# EAGLE schematic communication_module_20190522_with_TTGO-LoRa32 (EAGLE 9.4.0)
AUTHOR: iPAS
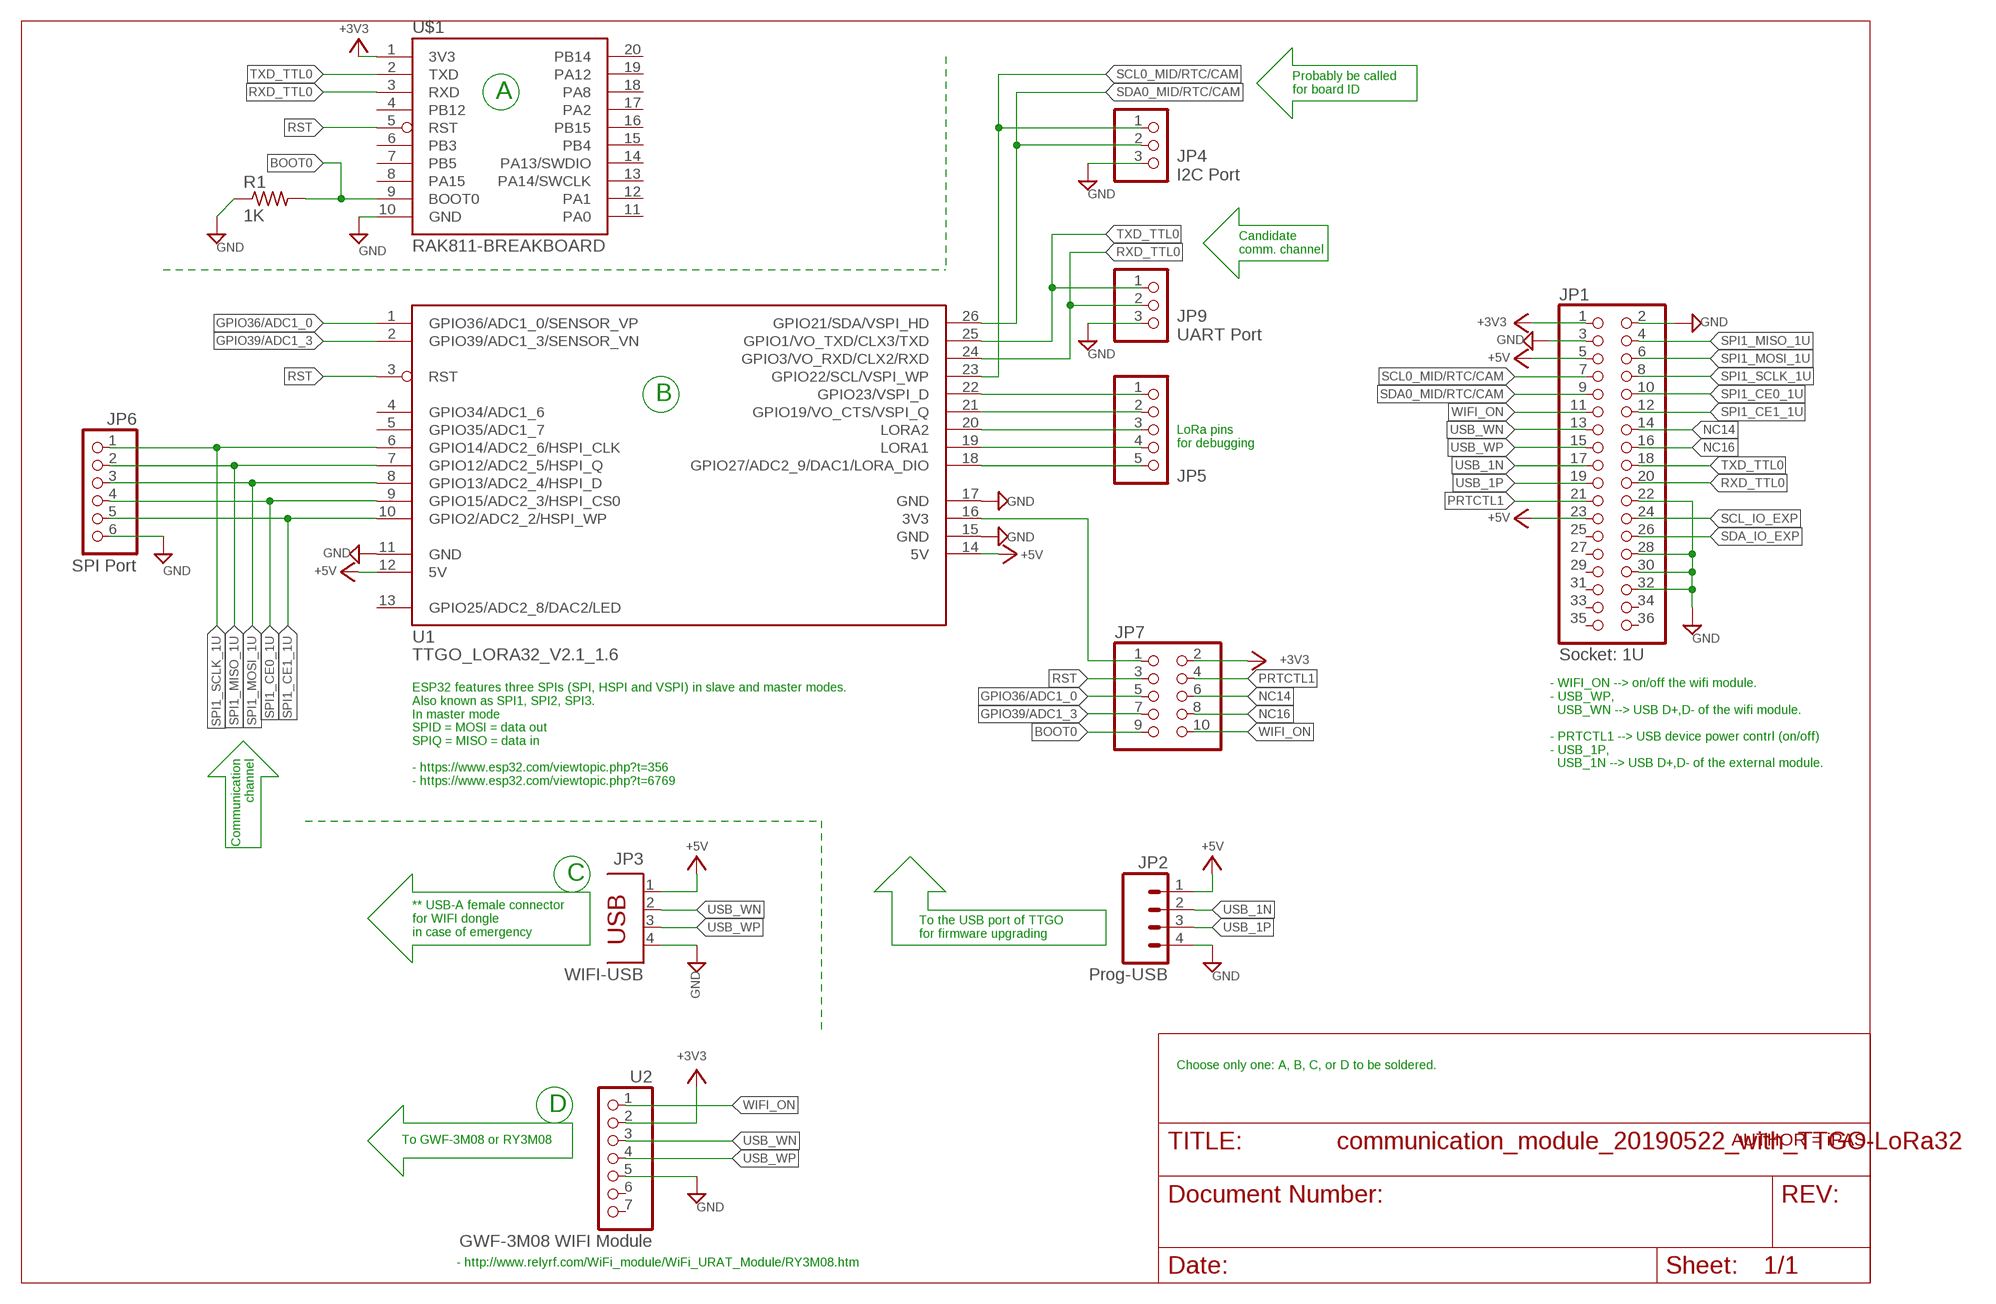
[diagram p0: schematic, sheet 1]
FRAME1 (DINA4_L): AUTHOR: iPAS

## Parts
JP1  Socket: 1U  PINHD-2X18  [2X18]
JP2  Prog-USB  M04PTH  [1X04]
JP3  WIFI-USB  PN87520  [PN87520]
JP4  I2C Port  PINHD-1X3  [1X03]
JP5  PINHD-1X5  [1X05]
JP6  SPI Port  PINHD-1X6  [1X06]
JP7  PINHD-2X5  [2X05]
JP9  UART Port  PINHD-1X3  [1X03]
R1  1K  RCL_R-US0204/2V  [RCL_0204V]
U1  TTGO_LORA32_V2.1_1.6  [TTGO_LORA32_V2.1_1.6]
U2  GWF-3M08 WIFI Module  PINHD-1X7  [1X07]
U$1  RAK811-BREAKBOARD  [RAK811-BREAKBOARD]

## Nets
+3V3: JP1.1 JP7.2 U2.2
+5V: JP1.5 JP1.23 JP2.1 JP3.1 U1.12(5V) U1.14(5V)
BOOT0: JP7.9 R1.2 U$1.9(BOOT0)
GND: JP1.2 JP1.3 JP1.22 JP1.28 JP1.30 JP1.32 JP2.4 JP3.4 JP4.3 JP6.6 JP9.3 R1.1 U1.11(GND) U1.15(GND) U1.17(GND) U2.5 U$1.10(GND)
GPIO36/ADC1_0: JP7.5 U1.1(GPIO36/ADC1_0/SENSOR_VP)
GPIO39/ADC1_3: JP7.7 U1.2(GPIO39/ADC1_3/SENSOR_VN)
N$2: JP7.1 U1.16(3V3)
N$3: JP5.1 U1.22(GPIO23/VSPI_D)
N$4: JP5.2 U1.21(GPIO19/VO_CTS/VSPI_Q)
N$5: JP5.3 U1.20(LORA2)
N$6: JP5.4 U1.19(LORA1)
N$7: JP5.5 U1.18(GPIO27/ADC2_9/DAC1/LORA_DIO)
N$12: U$1.1(3V3) ; supply symbol labelled +3V3
NC14: JP1.14 JP7.6
NC16: JP1.16 JP7.8
PRTCTL1: JP1.21 JP7.4
RST: JP7.3 U1.3(RST) U$1.5(RST)
RXD_TTL0: JP1.20 JP9.2 U1.24(GPIO3/VO_RXD/CLX2/RXD) U$1.3(RXD)
SCL0_MID/RTC/CAM: JP1.7 JP4.1 U1.23(GPIO22/SCL/VSPI_WP)
SCL_IO_EXP: JP1.24
SDA0_MID/RTC/CAM: JP1.9 JP4.2 U1.26(GPIO21/SDA/VSPI_HD)
SDA_IO_EXP: JP1.26
SPI1_CE0_1U: JP1.10 JP6.4 U1.9(GPIO15/ADC2_3/HSPI_CS0)
SPI1_CE1_1U: JP1.12 JP6.5 U1.10(GPIO2/ADC2_2/HSPI_WP)
SPI1_MISO_1U: JP1.4 JP6.2 U1.7(GPIO12/ADC2_5/HSPI_Q)
SPI1_MOSI_1U: JP1.6 JP6.3 U1.8(GPIO13/ADC2_4/HSPI_D)
SPI1_SCLK_1U: JP1.8 JP6.1 U1.6(GPIO14/ADC2_6/HSPI_CLK)
TXD_TTL0: JP1.18 JP9.1 U1.25(GPIO1/VO_TXD/CLX3/TXD) U$1.2(TXD)
USB_1N: JP1.17 JP2.2
USB_1P: JP1.19 JP2.3
USB_WN: JP1.13 JP3.2 U2.3
USB_WP: JP1.15 JP3.3 U2.4
WIFI_ON: JP1.11 JP7.10 U2.1
Unconnected: JP1.25 JP1.27 JP1.29 JP1.31 JP1.33 JP1.34 JP1.35 JP1.36 U1.4(GPIO34/ADC1_6) U1.5(GPIO35/ADC1_7) U1.13(GPIO25/ADC2_8/DAC2/LED) U2.6 U2.7 U$1.4(PB12) U$1.6(PB3) U$1.7(PB5) U$1.8(PA15) U$1.11(PA0) U$1.12(PA1) U$1.13(PA14/SWCLK) U$1.14(PA13/SWDIO) U$1.15(PB4) U$1.16(PB15) U$1.17(PA2) U$1.18(PA8) U$1.19(PA12) U$1.20(PB14)

## Notes on the sheet
- Probably be called
  for board ID
- A
- Candidate 
  comm. channel
- B
- LoRa pins
  for debugging
- Communication
  channel
- - WIFI_ON --> on/off the wifi module.
  - USB_WP, 
    USB_WN --> USB D+,D- of the wifi module.
  
  - PRTCTL1 --> USB device power contrl (on/off)
  - USB_1P, 
    USB_1N --> USB D+,D- of the external module.
- ESP32 features three SPIs (SPI, HSPI and VSPI) in slave and master modes. 
  Also known as SPI1, SPI2, SPI3.
  In master mode 
  SPID = MOSI = data out
  SPIQ = MISO = data in
  
  - https://www.esp32.com/viewtopic.php?t=356
  - https://www.esp32.com/viewtopic.php?t=6769
- C
- ** USB-A female connector
  for WIFI dongle
  in case of emergency
- To the USB port of TTGO
  for firmware upgrading
- Choose only one: A, B, C, or D to be soldered.
- D
- To GWF-3M08 or RY3M08
- - http://www.relyrf.com/WiFi_module/WiFi_URAT_Module/RY3M08.htm

## Library data of the parts
JP1 = pinhead:PINHD-2X18: PIN HEADER
JP2 = ipas:M04: Header 4 Standard 4-pin 0.1" header. Use with straight break away headers (SKU : PRT-00116), right angle break away headers (PRT-00553), swiss pins (PRT-00743), machine pins (PRT-00117), and female headers (PRT-00115). Molex polarized connector foot print use with SKU : PRT-08231 with associated crimp pins and housings. 1MM SMD Version SKU: PRT-10208
JP3 = con-berg:PN87520: BERG USB connector; OC_FARNELL: unknown; OC_NEWARK: unknown
JP4 JP9 = pinhead:PINHD-1X3: PIN HEADER
JP5 = pinhead:PINHD-1X5: PIN HEADER
JP6 = pinhead:PINHD-1X6: PIN HEADER
JP7 = pinhead:PINHD-2X5: PIN HEADER
R1 = ipas:RCL_R-US: RESISTOR, American symbol
U1 = ipas:TTGO_LORA32_V2.1_1.6: .
U2 = pinhead:PINHD-1X7: PIN HEADER
U$1 = ipas:RAK811-BREAKBOARD